# Altium schematic sheet STLINK.SchDoc: STLINK
size A3; Project: STM32L073Z-EVAL; Date: Not used; ApprovedBy: Not used; CheckedBy: Not used; Author: Not used; CompanyName: STMicroelectronics; DrawnBy: Not used; Engineer: Not used; Organization: Not used; Address1: Not used; Address2: Not used; Address3: Not used; Address4: Not used; DocumentNumber: 12; Revision: Not used; SheetNumber: 13; SheetTotal: 13; CurrentTime: Not used; CurrentDate: Not used; Time: Not used; DocumentFullPathAndName: Not used; DocumentName: Not used; ModifiedDate: Not used; ImagePath: Not used; ProjectName: Not used; Application_BuildNumber: Not used
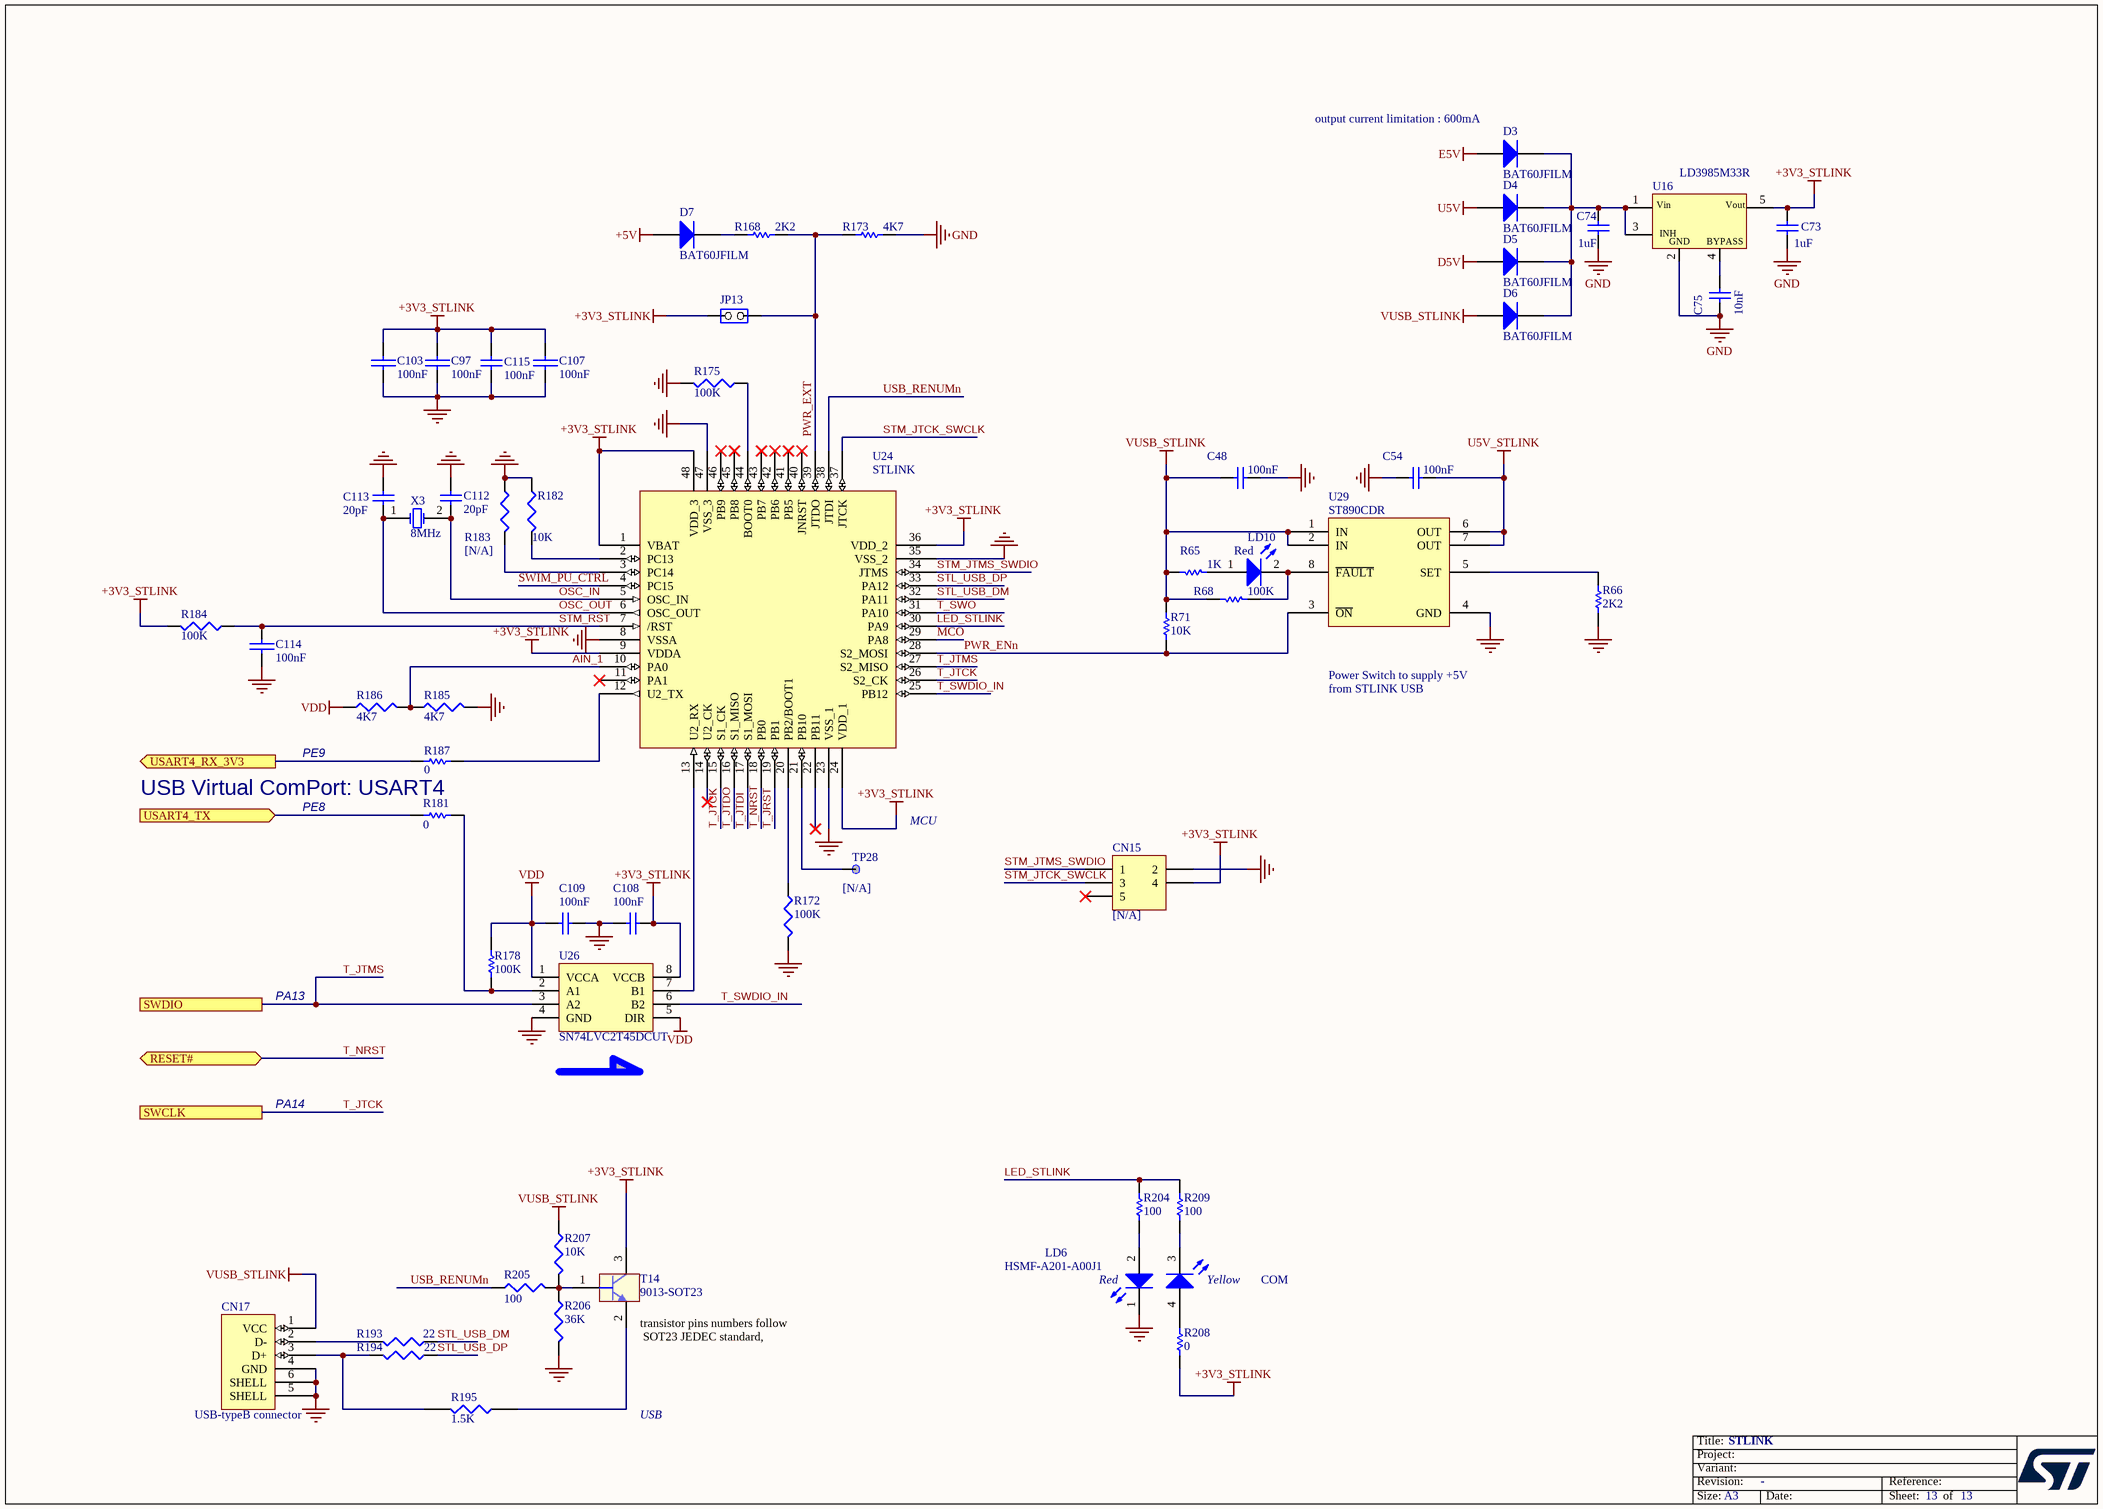
[diagram p0: STLINK.SchDoc]

## Parts
C48  100nF  [0402C]
C54  100nF  [0402C]
C73  1uF  [0603C]
C74  1uF  [0603C]
C75  10nF  [0402C]
C97  100nF  [0402C]
C103  100nF  [0402C]
C107  100nF  [0402C]
C108  100nF  [0402C]
C109  100nF  [0402C]
C112  20pF  [0402C]
C113  20pF  [0402C]
C114  100nF  [0402C]
C115  100nF  [0402C]
CN15  [N/A]  [HDR_2X3-1_2R54-6]
CN17  USB-typeB connector  [USB-B]
D3  BAT60JFILM  [SOD-323]
D4  BAT60JFILM  [SOD-323]
D5  BAT60JFILM  [SOD-323]
D6  BAT60JFILM  [SOD-323]
D7  BAT60JFILM  [SOD-323]
JP13  (no value)  [SIP2]
LD6  HSMF-A201-A00J1  Silkscreen: COM  [LED2_3528]
LD10  Red  [0603D]
R65  1K  [0402R]
R66  2K2  [0402R]
R68  100K  [0402R]
R71  10K  [0402R]
R168  2K2  [0402R]
R172  100K  [0402R]
R173  4K7  [0402R]
R175  100K  [0402R]
R178  100K  [0402R]
R181  0  [0603R]
R182  10K  [0402R]
R183  [N/A]  [0603R]
R184  100K  [0402R]
R185  4K7  [0402R]
R186  4K7  [0402R]
R187  0  [0603R]
R193  22  [0402R]
R194  22  [0402R]
R195  1.5K  [0402R]
R204  100  [0402R]
R205  100  [0402R]
R206  36K  [0402R]
R207  10K  [0402R]
R208  0  [0603R]
R209  100  [0402R]
T14  9013-SOT23  [SOT-23]
TP28  [N/A]  [TP]
U16  LD3985M33R  [SOT23-5]
U24  STLINK  [LQFP48_0R5_9X9]
U26  SN74LVC2T45DCUT  [USOP8_0R5_2X3R1]
U29  ST890CDR  [SOIC8_1R27_4R9X6]
X3  8MHz  [XTAL_2SM_12R7X4R7]

## Ports
RESET# (bidir), SWCLK, SWDIO, USART4_RX_3V3 (out), USART4_TX (in)

## Nets
+3V3_STLINK: C73.1 C97.2 C103.2 C107.2 C108.1 C115.1 CN15.4 JP13.1(COMMON) R184.2 R208.2 T14.3(C) U16.5(Vout) U24.1(VBAT) U24.9(VDDA) U24.24(VDD_1) U24.36(VDD_2) U24.48(VDD_3) U26.8(VCCB)
+5V: D7.1(A)
D5V: D5.1(A)
E5V: D3.1(A)
GND: C48.2 C54.1 C73.2 C74.2 C75.2 C97.1 C103.1 C107.1 C108.2 C109.2 C112.1 C113.1 C114.1 C115.2 CN15.2 CN17.4(GND) CN17.5(SHELL) CN17.6(SHELL) LD6.1(RED_cathode) R66.2 R172.2 R173.1 R175.2 R182.1 R183.1 R185.2 R206.2 U16.2(GND) U24.8(VSSA) U24.23(VSS_1) U24.35(VSS_2) U24.47(VSS_3) U26.4(GND) U29.4(GND)
U5V: D4.1(A)
U5V_STLINK: C54.2 U29.6(OUT) U29.7(OUT)
VDD: C109.1 R178.1 R186.1 U26.1(VCCA) U26.5(DIR)
VUSB_STLINK: C48.1 CN17.1(VCC) D6.1(A) R65.1 R68.1 R71.2 R207.1 U29.1(IN) U29.2(IN)
AIN_1: R185.1 R186.2 U24.10(PA0)
LED_STLINK: R204.1 R209.1 U24.30(PA9)
MCO: U24.29(PA8)
OSC_IN: C112.2 U24.5(OSC_IN) X3.2(OSC2)
OSC_OUT: C113.2 U24.6(OSC_OUT) X3.1(OSC1)
PWR_ENn: R71.1 U24.28(S2_MOSI) U29.3(~{ON})
PWR_EXT: JP13.2(NO) R168.1 R173.2 U24.39(JTDO)
STL_USB_DM: R193.1 U24.32(PA11)
STL_USB_DP: R194.1 U24.33(PA12)
STM_JTCK_SWCLK: CN15.3 U24.37(JTCK)
STM_JTMS_SWDIO: CN15.1 U24.34(JTMS)
STM_RST: C114.2 R184.1 U24.7(/RST)
SWIM_PU_CTRL: U24.4(PC15)
T_JRST: U24.19(PB1)
T_JTCK: U24.15(S1_CK) U24.26(S2_CK) ; port SWCLK
T_JTDI: U24.17(S1_MOSI)
T_JTDO: U24.16(S1_MISO)
T_JTMS: U24.27(S2_MISO) U26.3(A2) ; port SWDIO
T_NRST: U24.18(PB0) ; port RESET#
T_SWDIO_IN: U24.25(PB12) U26.6(B2)
T_SWO: U24.31(PA10)
USART4_RX_3V3: R187.2 ; port USART4_RX_3V3
USART4_TX: R181.1 ; port USART4_TX
USB_RENUMn: R205.1 U24.38(JTDI)
NetC74_1: C74.1 D3.2(K) D4.2(K) D5.2(K) D6.2(K) U16.1(Vin) U16.3(CE)
NetC75_1: C75.1 U16.4(BYPASS)
NetCN17_2: CN17.2(D-) R193.2
NetCN17_3: CN17.3(D+) R194.2 R195.2
NetD7_2: D7.2(K) R168.2
NetLD6_2: LD6.2(Red_anode) R204.2
NetLD6_3: LD6.3(YellowGreen_cathode) R209.2
NetLD6_4: LD6.4(YellowGreen_anode) R208.1
NetLD10_1: LD10.1(A) R65.2
NetLD10_2: LD10.2(K) R68.2 U29.8(~{FAULT})
NetR66_1: R66.1 U29.5(SET)
NetR172_1: R172.1 U24.20(PB2/BOOT1)
NetR175_1: R175.1 U24.44(BOOT0)
NetR178_2: R178.2 R181.2 U26.2(A1)
NetR182_2: R182.2 U24.2(PC13)
NetR183_2: R183.2 U24.3(PC14)
NetR187_1: R187.1 U24.12(U2_TX)
NetR195_1: R195.1 T14.2(E)
NetR205_2: R205.2 R206.1 R207.2 T14.1(B)
NetTP28_1: TP28.1 U24.21(PB10)
NetU24_13: U24.13(U2_RX) U26.7(B1)

Not connected (* = marked no-connect by the designer): CN15 5*; U24 11(PA1)* 14(U2_CK)* 22(PB11)* 40(JNRST)* 41(PB5)* 42(PB6)* 43(PB7)* 45(PB8)* 46(PB9)*

## Notes on the sheet
- (near D3) output current limitation : 600mA
- Power Switch to supply +5V from STLINK USB
- PE9
- USB Virtual ComPort: USART4
- PE8
- MCU
- PA13
- PA14
- (near T14) transistor pins numbers follow
  SOT23 JEDEC standard,
- USB
- Title:
- Project:
- Size:
- Revision:
- Variant:
- A3
- -
- Date:
- Reference:
- Sheet:
- of
- (in symbol HSMF-A201-A00J1) Red; Yellow
- (in symbol LD3985M33R) INH

## Library data of the parts
C48 C54 = Capacitor_ST: Capacitor 0402 / 0603 / 0805; Ordered by: Subcon; Revision: July-2002: Re-released for DXP Platform.; Value: 100nF; ECCN_US/EU: n/a
C73 C74 = CAP: Capacitor; Value: 100nF; Ordered by: Subcon; Published: 8-Jun-2000; Revision: July-2002: Re-released for DXP Platform.; Publisher: Altium Limited; ECCN_US/EU: n/a
C75 = Cap: Capacitor; Ordered by: Subcon; Published: 8-Jun-2000; Revision: July-2002: Re-released for DXP Platform.; Publisher: Altium Limited; Value: 10nF; ECCN_US/EU: n/a
C97 C103 C107 C114 = CAP: Ordered by: Subcon; ECCN_US/EU: n/a
C108 C109 C112 C113 = CAP: Capacitor; Value: 100pF; Ordered by: Subcon; Published: 8-Jun-2000; Revision: July-2002: Re-released for DXP Platform.; Publisher: Altium Limited; ECCN_US/EU: n/a
C115 = Cap: Capacitor; Value: 10nF; Ordered by: Subcon; Published: 8-Jun-2000; Revision: July-2002: Re-released for DXP Platform.; Publisher: Altium Limited; ECCN_US/EU: n/a
CN15 = Header 3X2: Header, 3-Pin, Dual row; Ordered by: Subcon; Fitted: NO; Revision: 17-Jul-2002: Re-released for DXP Platform.; Publisher: Altium Limited; ECCN_US/EU: n/a
CN17 = USB-typeB connector: Manuf_1: txgagroup; Manuf_Part_1: 4414BF20BO; Ordered by: Subcon; Silkscreen: ST-LINK/V2; ECCN_US/EU: n/a
D3-D7 = Diode: Default Diode; Code - JEDEC: DO-214-AB; Ordered by: ST; ECCN_US/EU: EAR99/NEC; Ref St: 9151097; Published: 8-Jun-2000; Revision: July-2002: Re-released for DXP Platform.; Publisher: Altium Limited; Manuf_1: ST; Manuf_Part_1: BAT60JFILM
JP13 = JP2: Ordered by: Subcon; Silkscreen: Pwr_ext; Assembly: opened; ECCN_US/EU: n/a
LD6 = HSMF-A201-A00J1: Ordered by: Subcon; ECCN_US/EU: n/a
LD10 = LED2: Typical RED, GREEN, YELLOW, AMBER GaAs LED; Ordered by: Subcon; Published: 8-Jun-2000; Revision: July-2002: Re-released for DXP Platform.; Publisher: Altium Limited; ECCN_US/EU: n/a
R65 = Res1: Resistor; Ordered by: Subcon; Published: 8-Jun-2000; Revision: July-2002: Re-released for DXP Platform.; Publisher: Altium Limited; Value: 1K; ECCN_US/EU: n/a
R66 R168 R173 = res1: Resistor; Value: 1K; Ordered by: Subcon; Published: 8-Jun-2000; Revision: July-2002: Re-released for DXP Platform.; Publisher: Altium Limited; ECCN_US/EU: n/a
R68 R178 R181 R187 R204 R208 R209 = Res1: Resistor; Value: 1K; Ordered by: Subcon; Published: 8-Jun-2000; Revision: July-2002: Re-released for DXP Platform.; Publisher: Altium Limited; ECCN_US/EU: n/a
R71 = Resistor_ST: Resistor; Ordered by: Subcon; Value: 10K; ECCN_US/EU: n/a
R172 R175 R184 R193 R194 = RES1: Resistor; Ordered by: Subcon; ECCN_US/EU: n/a
R182 R205-R207 = R: Resistor; Right: 20; Bottom: 30; Ordered by: Subcon; ECCN_US/EU: n/a
R183 = R: Right: 20; Bottom: 30; Ordered by: Subcon; Fitted: NO; ECCN_US/EU: n/a
R185 R186 R195 = RES1: Ordered by: Subcon; ECCN_US/EU: n/a
T14 = 9013-SOT23: NPN Bipolar Transistor; Manuf_Part_1: MMBT9013; Ordered by: Subcon; ECCN_US/EU: EAR99/NEC; Revision: July-2002: Re-released for DXP Platform.; Order: MMBT9013
TP28 = TP: Ordered by: Subcon; Fitted: NO; ECCN_US/EU: n/a
U16 = LD3985M33R: Ultra low drop-low noise BiCMOS voltage, regulators low ESR capacitors compatible; Manuf_1: ST; Ref St: 9176161; ECCN_US/EU: EAR99/NEC; Manuf_Part_1: LD3985M33R; Provided: ST; Distrib: ST; Order: LD3985M33R; Ordered by: ST
U24 = STM32F10x(48pin): Manuf_Part_1: STM32F103CBT6; Ordered by: ST; ECCN_US/EU: 3A991A2/NEC; Ref St: 9175111; Distrib: ST; Manuf_1: ST
U26 = SN74LVC2T45DCUT: Ordered by: Subcon; ECCN_US/EU: EAR99/NEC
U29 = ST890CDR: Ordered by: ST; ECCN_US/EU: EAR99/NEC; Ref St: 9172002; Manuf_1: ST; Manuf_Part_1: ST890CDR
X3 = XTAL: Crystal Oscillator; Ordered by: Subcon; Published: 8-Jun-2000; LatestRevisionDate: 17-Jul-2002; LatestRevisionNote: Re-released for DXP Platform.; PackageReference: R38; Publisher: Altium Limited; ECCN_US/EU: n/a